# EAGLE design combined_timer+remote (EAGLE 9.6.2)

## Sheet 1 of 3
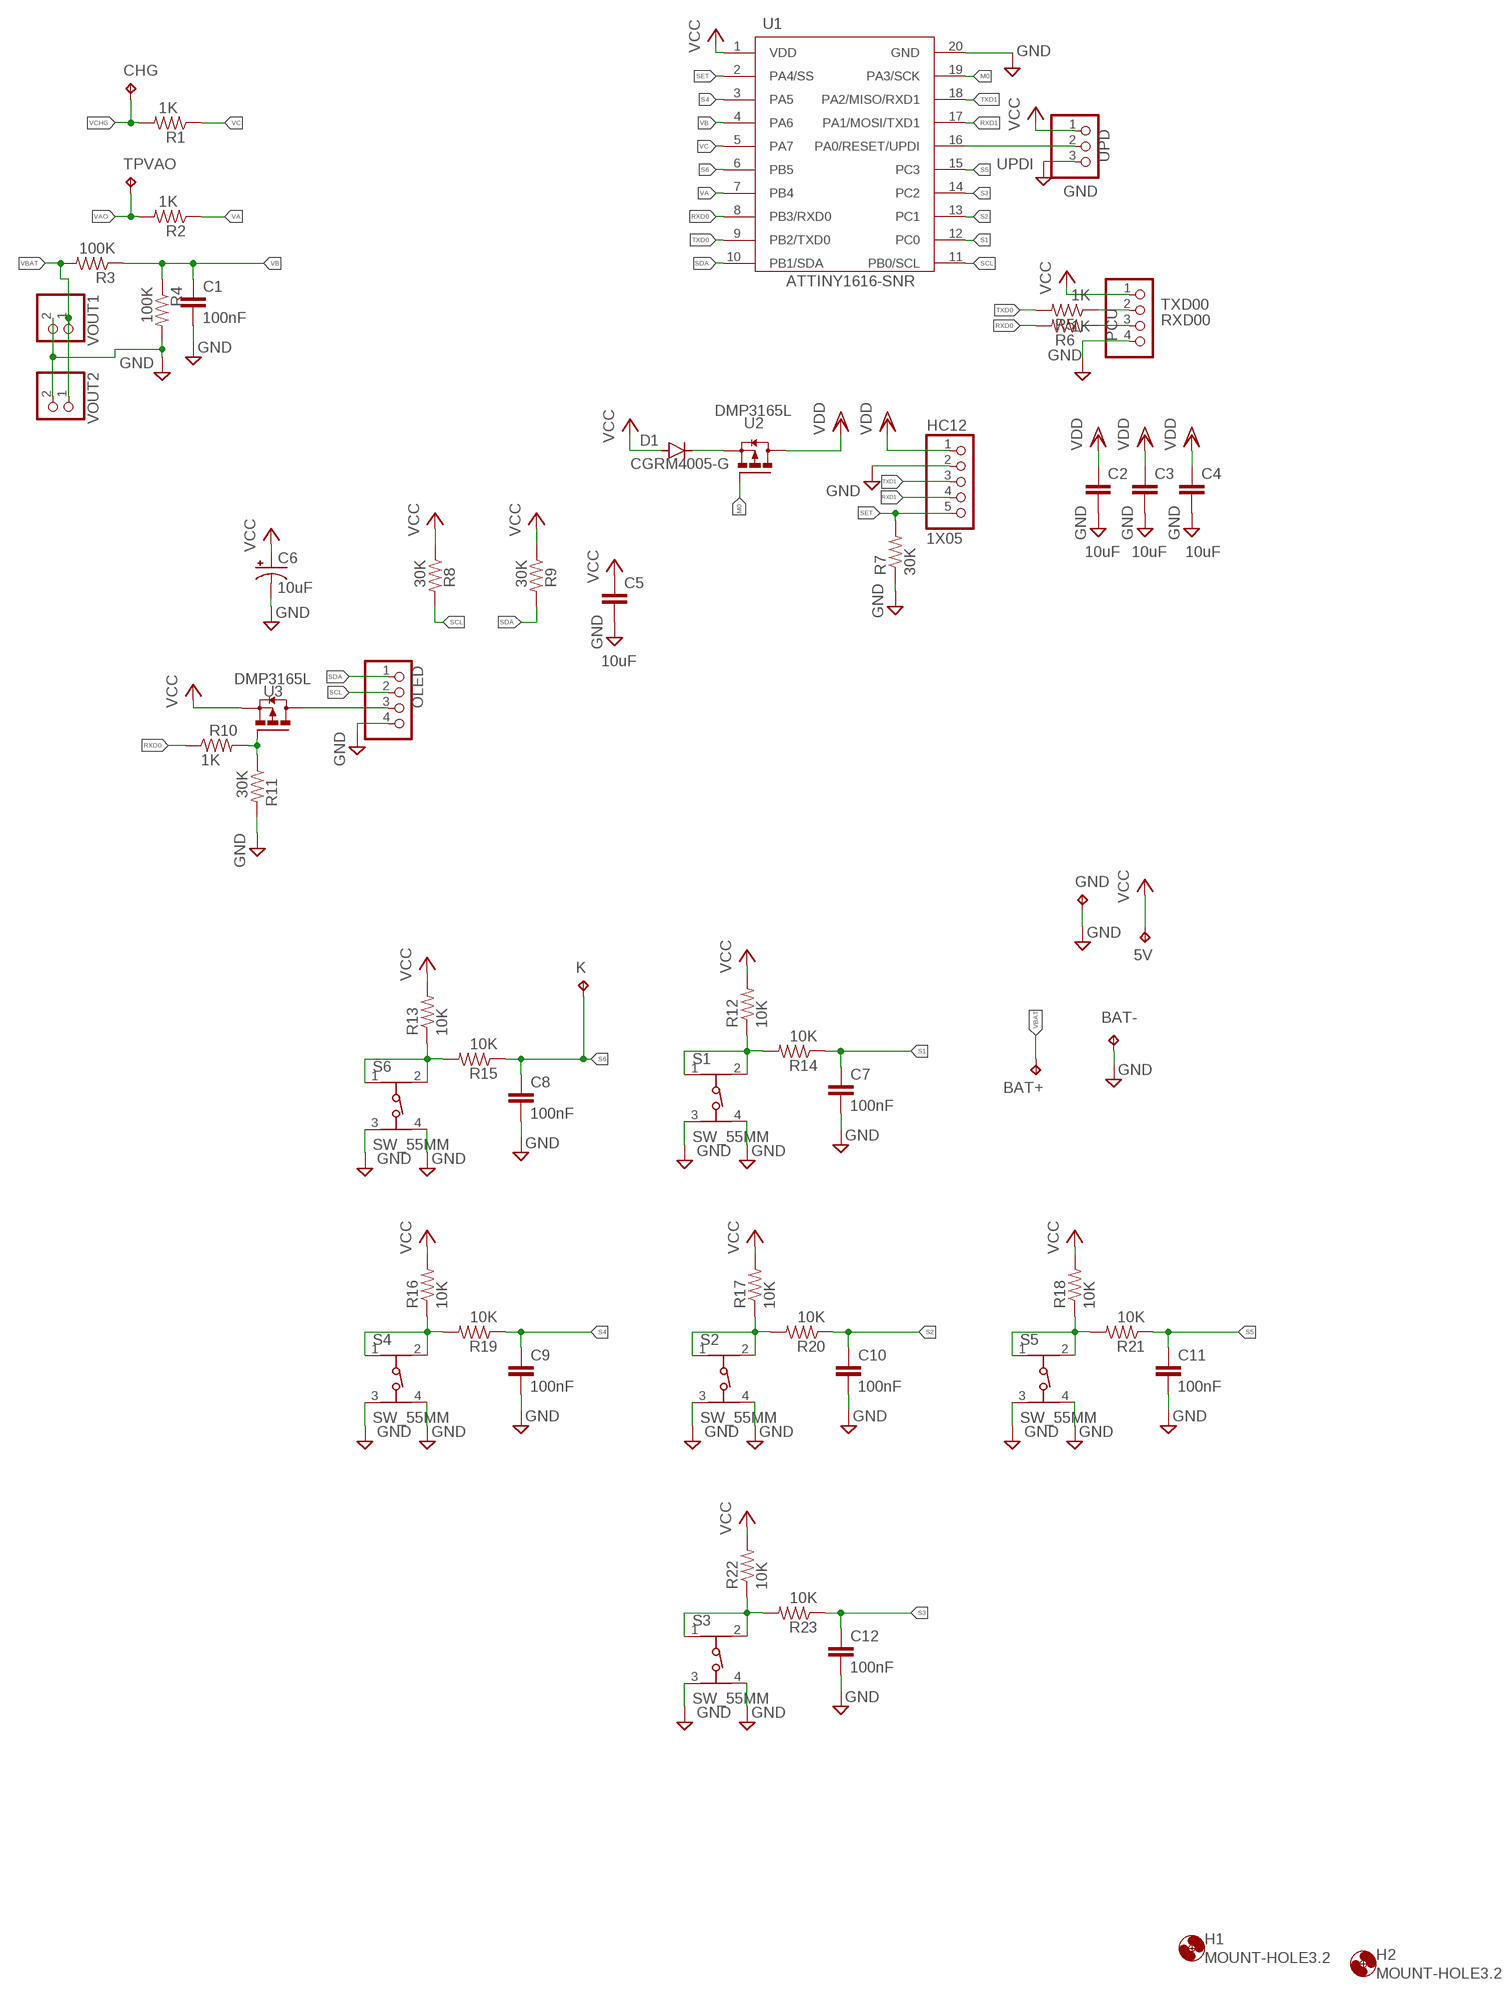
[diagram p0: schematic, sheet 1, part 1 of 2]
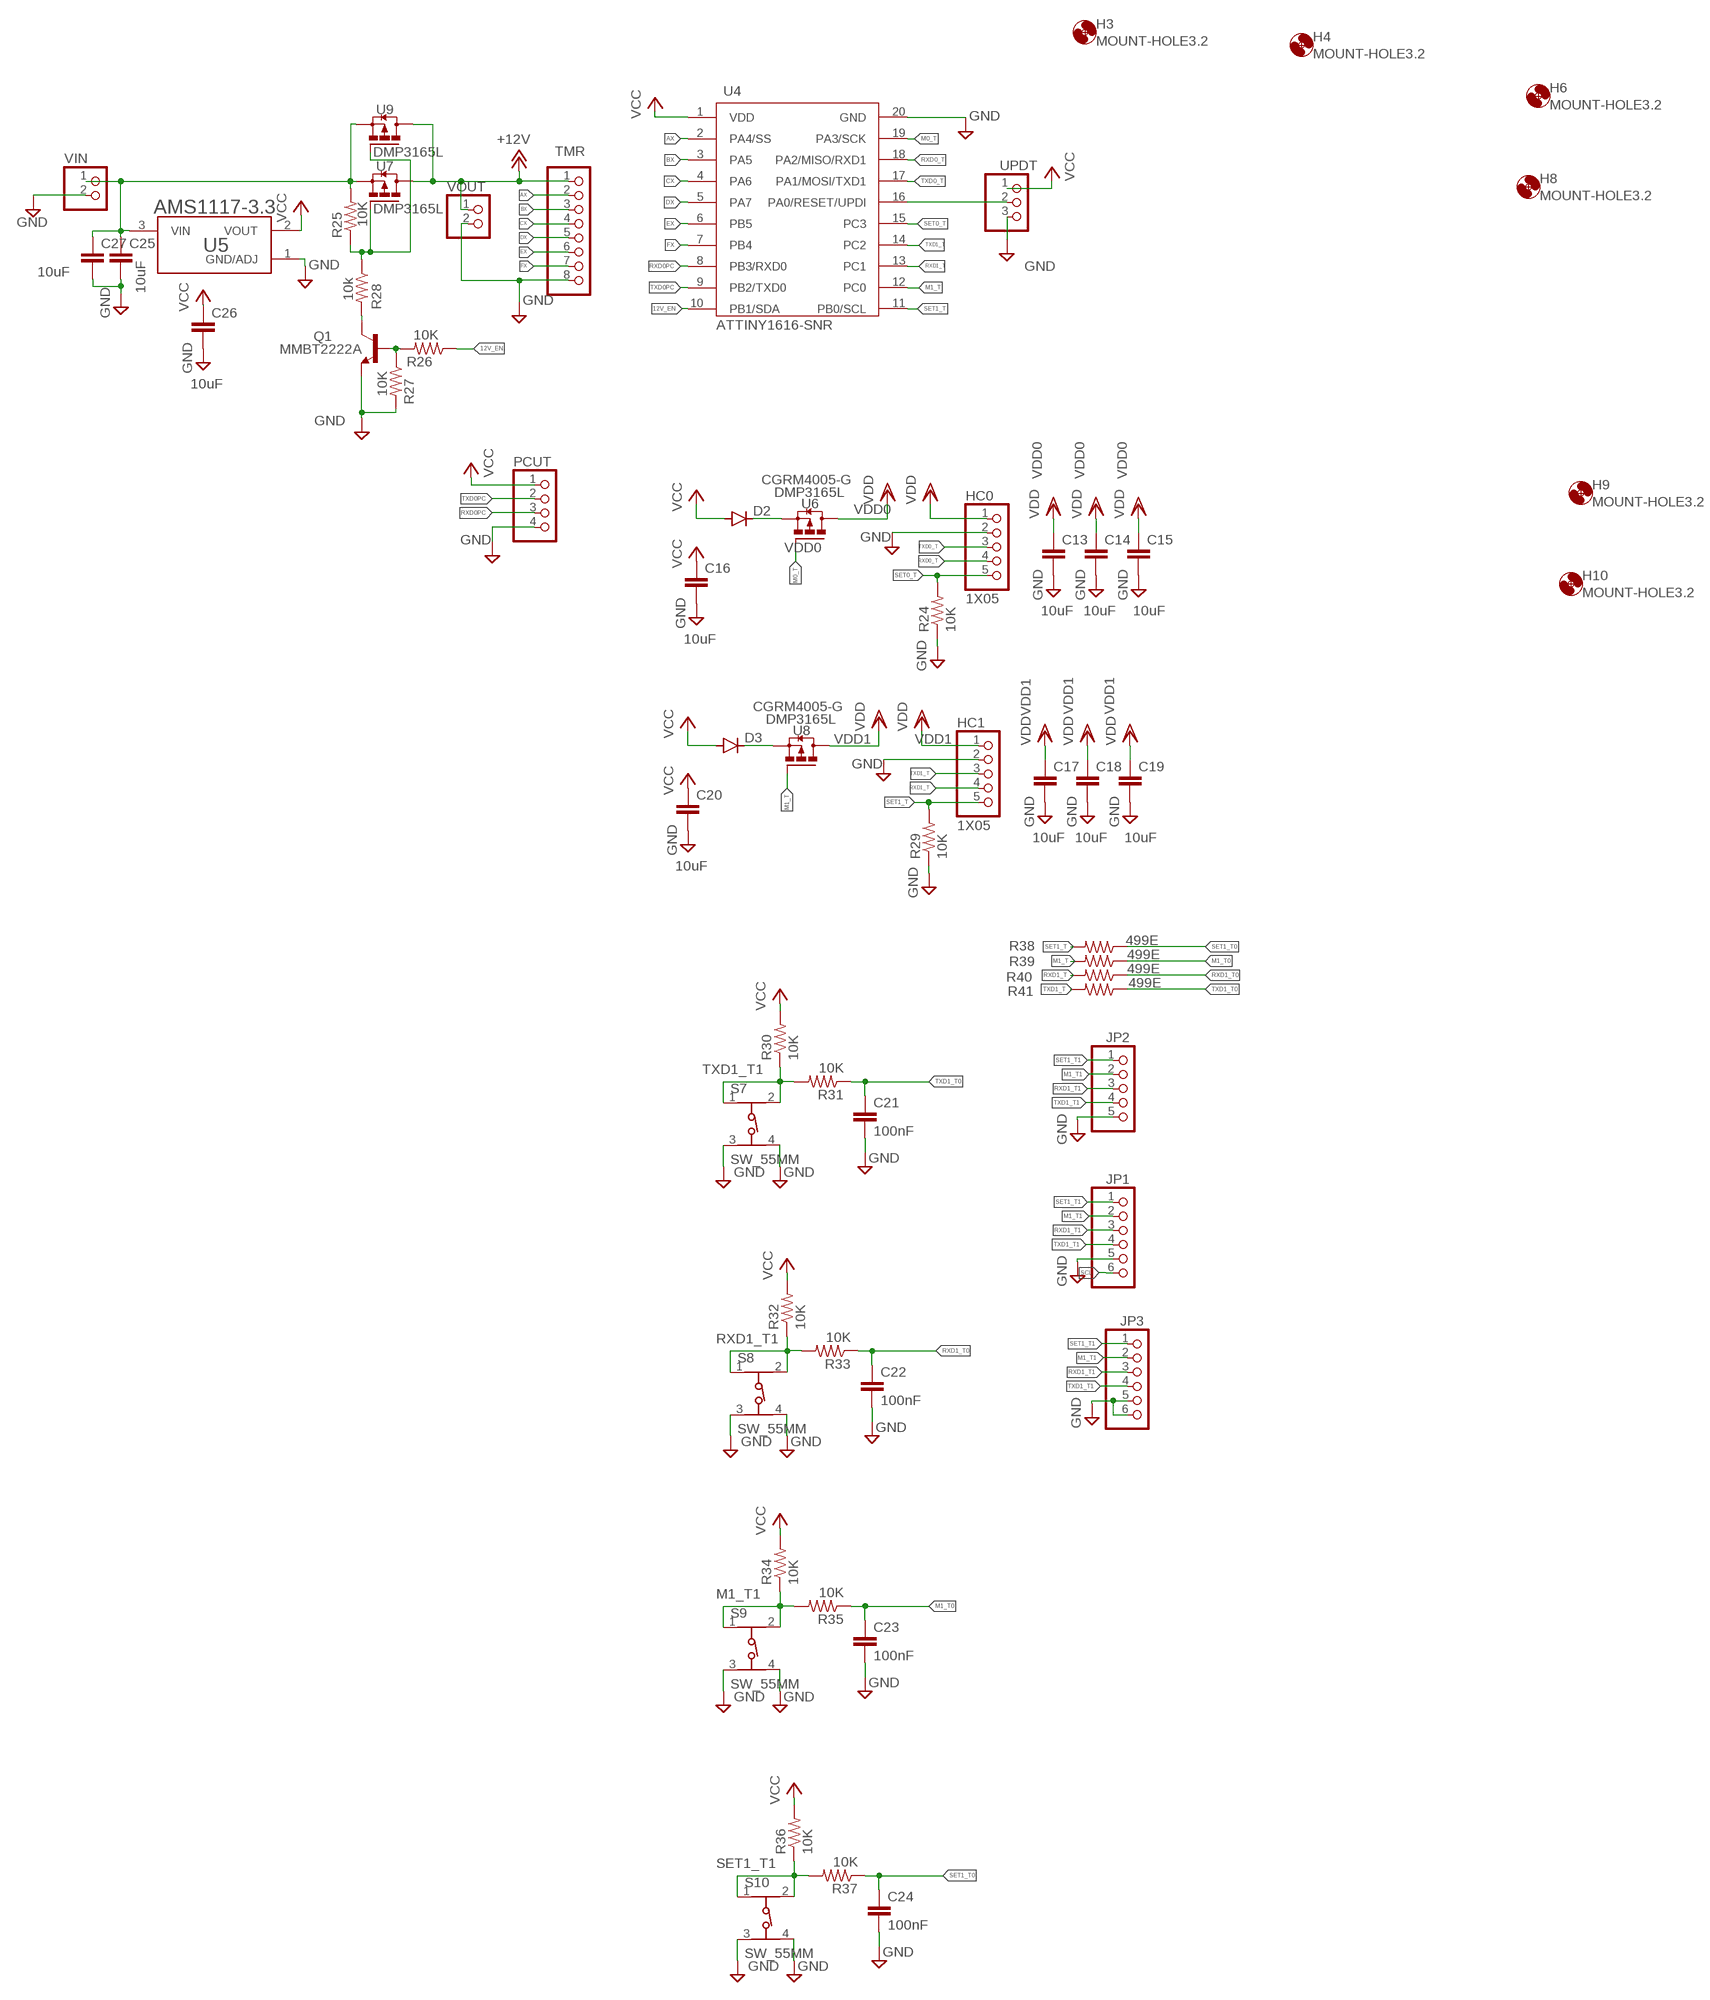
[diagram p1: schematic, sheet 1, part 2 of 2]

### Parts
5V  TPTP18R  [TP18R]
BAT+  TPTP18R  [TP18R]
BAT-  TPTP18R  [TP18R]
C1  100nF  C-EUC0603K  [C0603K]
C2  10uF  C-EUC0805  [C0805]
C3  10uF  C-EUC0805  [C0805]
C4  10uF  C-EUC0805  [C0805]
C5  10uF  C-EUC0805  [C0805]
C6  10uF  CPOL-USCT3528  [CT3528]
C7  100nF  C-EUC0603K  [C0603K]
C8  100nF  C-EUC0603K  [C0603K]
C9  100nF  C-EUC0603K  [C0603K]
C10  100nF  C-EUC0603K  [C0603K]
C11  100nF  C-EUC0603K  [C0603K]
C12  100nF  C-EUC0603K  [C0603K]
C13  10uF  C-EUC0805  [C0805]
C14  10uF  C-EUC0805  [C0805]
C15  10uF  C-EUC0805  [C0805]
C16  10uF  C-EUC0805  [C0805]
C17  10uF  C-EUC0805  [C0805]
C18  10uF  C-EUC0805  [C0805]
C19  10uF  C-EUC0805  [C0805]
C20  10uF  C-EUC0805  [C0805]
C21  100nF  C-EUC0603K  [C0603K]
C22  100nF  C-EUC0603K  [C0603K]
C23  100nF  C-EUC0603K  [C0603K]
C24  100nF  C-EUC0603K  [C0603K]
C25  10uF  C-EUC0805  [C0805]
C26  10uF  C-EUC0805  [C0805]
C27  10uF  C-EUC0805  [C0805]
CHG  TPTP18R  [TP18R]
D1  CGRM4005-G  [SOD-123_MINI-SMA]
D2  CGRM4005-G  [SOD-123_MINI-SMA]
D3  CGRM4005-G  [SOD-123_MINI-SMA]
GND  TPTP18R  [TP18R]
H1  MOUNT-HOLE3.2  [3,2]
H2  MOUNT-HOLE3.2  [3,2]
H3  MOUNT-HOLE3.2  [3,2]
H4  MOUNT-HOLE3.2  [3,2]
H6  MOUNT-HOLE3.2  [3,2]
H8  MOUNT-HOLE3.2  [3,2]
H9  MOUNT-HOLE3.2  [3,2]
H10  MOUNT-HOLE3.2  [3,2]
HC0  1X05  [1X05X254]
HC1  1X05  [1X05X254]
HC12  1X05  [1X05X254]
JP1  PINHD-1X06_2.54-S  [1X06-S]
JP2  PINHD-1X5  [1X05]
JP3  PINHD-1X06_2.54-S  [1X06-S]
K  TPTP18R  [TP18R]
OLED  PINHD-1X04_2.54-S  [1X04-S]
PCU  PINHD-1X04_2.54-S  [1X04-S]
PCUT  PINHD-1X04_2.54-S  [1X04-S]
Q1  MMBT2222A  [SOT23]
R1  1K  R-US_R0603  [R0603]
R2  1K  R-US_R0603  [R0603]
R3  100K  R-US_R0603  [R0603]
R4  100K  R-US_R0603  [R0603]
R5  1K  R-US_R0805  [R0805]
R6  1K  R-US_R0805  [R0805]
R7  30K  R-US_R0603  [R0603]
R8  30K  R-US_R0603  [R0603]
R9  30K  R-US_R0603  [R0603]
R10  1K  R-US_R0603  [R0603]
R11  30K  R-US_R0603  [R0603]
R12  10K  R-US_R0603  [R0603]
R13  10K  R-US_R0603  [R0603]
R14  10K  R-US_R0603  [R0603]
R15  10K  R-US_R0603  [R0603]
R16  10K  R-US_R0603  [R0603]
R17  10K  R-US_R0603  [R0603]
R18  10K  R-US_R0603  [R0603]
R19  10K  R-US_R0603  [R0603]
R20  10K  R-US_R0603  [R0603]
R21  10K  R-US_R0603  [R0603]
R22  10K  R-US_R0603  [R0603]
R23  10K  R-US_R0603  [R0603]
R24  10K  R-US_R0603  [R0603]
R25  10K  R-US_R0603  [R0603]
R26  10K  R-US_R0603  [R0603]
R27  10K  R-US_R0603  [R0603]
R28  10k  R-US_R0603  [R0603]
R29  10K  R-US_R0603  [R0603]
R30  10K  R-US_R0603  [R0603]
R31  10K  R-US_R0603  [R0603]
R32  10K  R-US_R0603  [R0603]
R33  10K  R-US_R0603  [R0603]
R34  10K  R-US_R0603  [R0603]
R35  10K  R-US_R0603  [R0603]
R36  10K  R-US_R0603  [R0603]
R37  10K  R-US_R0603  [R0603]
R38  499E  R-US_R0603  [R0603]
R39  499E  R-US_R0603  [R0603]
R40  499E  R-US_R0603  [R0603]
R41  499E  R-US_R0603  [R0603]
S1  SW_55MM  [SW_55MM]
S2  SW_55MM  [SW_55MM]
S3  SW_55MM  [SW_55MM]
S4  SW_55MM  [SW_55MM]
S5  SW_55MM  [SW_55MM]
S6  SW_55MM  [SW_55MM]
S7  SW_55MM  [SW_55MM]
S8  SW_55MM  [SW_55MM]
S9  SW_55MM  [SW_55MM]
S10  SW_55MM  [SW_55MM]
TMR  PINHD-1X08_2.54-S  [1X08-S]
TPVAO  TPTP18R  [TP18R]
U1  ATTINY1616-SNR  [SOIC127P1032X265-20N]
U2  DMP3165L  [SOT103P240X110-3N]
U3  DMP3165L  [SOT103P240X110-3N]
U4  ATTINY1616-SNR  [SOIC127P1032X265-20N]
U5  AMS1117-3.3  [SOT229P700X180-4N]
U6  DMP3165L  [SOT103P240X110-3N]
U7  DMP3165L  [SOT103P240X110-3N]
U8  DMP3165L  [SOT103P240X110-3N]
U9  DMP3165L  [SOT103P240X110-3N]
UPD  PINHD-1X03_2.54-S  [1X03-S]
UPDT  PINHD-1X03_2.54-S  [1X03-S]
VIN  PINHD-1X2  [1X02]
VOUT  PINHD-1X2  [1X02]
VOUT1  PINHD-1X02_2.54-S  [1X02-S]
VOUT2  PINHD-1X02_2.54-S  [1X02-S]

### Nets
12V_EN: R26.1 U4.10(PB1/SDA)
12VIN: C25.1 C27.1 R25.2 U5.3(VIN) U7.2(S) U9.2(S) VIN.1
+12V: TMR.1 U7.3(D) U9.3(D) VOUT.1
AX: TMR.2 U4.2(PA4/SS)
BX: TMR.3 U4.3(PA5)
CX: TMR.4 U4.4(PA6)
DX: TMR.5 U4.5(PA7)
EX: TMR.6 U4.6(PB5)
FX: TMR.7 U4.7(PB4)
GND: BAT-.TP C1.2 C2.2 C3.2 C4.2 C5.2 C6.- C7.2 C8.2 C9.2 C10.2 C11.2 C12.2 C13.2 C14.2 C15.2 C16.2 C17.2 C18.2 C19.2 C20.2 C21.2 C22.2 C23.2 C24.2 C25.2 C26.2 C27.2 GND.TP HC0.2 HC1.2 HC12.2 JP1.5 JP2.5 JP3.5 JP3.6 OLED.4 PCU.4 PCUT.4 Q1.2(E) R4.2 R7.1 R11.2 R24.1 R27.2 R29.1 S1.3 S1.4 S2.3 S2.4 S3.3 S3.4 S4.3 S4.4 S5.3 S5.4 S6.3 S6.4 S7.3 S7.4 S8.3 S8.4 S9.3 S9.4 S10.3 S10.4 TMR.8 U1.20(GND) U4.20(GND) U5.1(GND/ADJ) UPD.3 UPDT.3 VIN.2 VOUT1.2 VOUT2.2 VOUT.2
M0: U1.19(PA3/SCK) U2.1(G)
M0_T: U4.19(PA3/SCK) U6.1(G)
M1_T: R39.2 U4.12(PC0) U8.1(G)
M1_T0: C23.1 R35.1 R39.1
M1_T1: JP1.2 JP2.2 JP3.2 R34.1 R35.2 S9.1 S9.2
N$1: R13.1 R15.2 S6.1 S6.2
N$2: D1.C U2.2(S)
N$3: OLED.3 U3.3(D)
N$4: R10.2 R11.1 U3.1(G)
N$5: R17.1 R20.2 S2.1 S2.2
N$6: D2.C U6.2(S)
N$8: R22.1 R23.2 S3.1 S3.2
N$9: R16.1 R19.2 S4.1 S4.2
N$10: R18.1 R21.2 S5.1 S5.2
N$11: Q1.1(B) R26.2 R27.1
N$12: R12.1 R14.2 S1.1 S1.2
N$13: Q1.3(C) R28.2
N$14: D3.C U8.2(S)
N$17: R25.1 R28.1 U7.1(G) U9.1(G)
N$23: U4.16(PA0/RESET/UPDI) UPDT.2
RXD0: R6.2 R10.1 U1.8(PB3/RXD0)
RXD00: PCU.3 R6.1
RXD0_T: HC0.4 U4.18(PA2/MISO/RXD1)
RXD0PC: PCUT.3 U4.8(PB3/RXD0)
RXD1: HC12.4 U1.17(PA1/MOSI/TXD1)
RXD1_T: HC1.4 R40.2 U4.13(PC1)
RXD1_T0: C22.1 R33.1 R40.1
RXD1_T1: JP1.3 JP2.3 JP3.3 R32.1 R33.2 S8.1 S8.2
S1: C7.1 R14.1 U1.12(PC0)
S2: C10.1 R20.1 U1.13(PC1)
S3: C12.1 R23.1 U1.14(PC2)
S4: C9.1 R19.1 U1.3(PA5)
S5: C11.1 R21.1 U1.15(PC3)
S6: C8.1 K.TP R15.1 U1.6(PB5)
SCL: JP1.6 OLED.2 R8.2 U1.11(PB0/SCL)
SDA: OLED.1 R9.2 U1.10(PB1/SDA)
SET: HC12.5 R7.2 U1.2(PA4/SS)
SET0_T: HC0.5 R24.2 U4.15(PC3)
SET1_T: HC1.5 R29.2 R38.2 U4.11(PB0/SCL)
SET1_T0: C24.1 R37.1 R38.1
SET1_T1: JP1.1 JP2.1 JP3.1 R36.1 R37.2 S10.1 S10.2
TXD0: R5.2 U1.9(PB2/TXD0)
TXD00: PCU.2 R5.1
TXD0_T: HC0.3 U4.17(PA1/MOSI/TXD1)
TXD0PC: PCUT.2 U4.9(PB2/TXD0)
TXD1: HC12.3 U1.18(PA2/MISO/RXD1)
TXD1_T: HC1.3 R41.2 U4.14(PC2)
TXD1_T0: C21.1 R31.1 R41.1
TXD1_T1: JP1.4 JP2.4 JP3.4 R30.1 R31.2 S7.1 S7.2
UPDI: U1.16(PA0/RESET/UPDI) UPD.2
VA: R2.1 U1.7(PB4)
VAO: R2.2 TPVAO.TP
VB: C1.1 R3.1 R4.1 U1.4(PA6)
VBAT: BAT+.TP R3.2 VOUT1.1 VOUT2.1
VC: R1.1 U1.5(PA7)
VCC: 5V.TP C5.1 C6.+ C16.1 C20.1 C26.1 D1.A D2.A D3.A PCU.1 PCUT.1 R8.1 R9.1 R12.2 R13.2 R16.2 R17.2 R18.2 R22.2 R30.2 R32.2 R34.2 R36.2 U1.1(VDD) U3.2(S) U4.1(VDD) U5.2(VOUT) UPD.1 UPDT.1
VCHG: CHG.TP R1.2
VDD: C2.1 C3.1 C4.1 HC12.1 U2.3(D)
VDD0: C13.1 C14.1 C15.1 HC0.1 U6.3(D) ; supply symbol labelled VDD
VDD1: C17.1 C18.1 C19.1 HC1.1 U8.3(D) ; supply symbol labelled VDD

## Sheet 2 of 3

## Sheet 3 of 3

## Library data of the parts
5V BAT+ BAT- CHG GND K TPVAO = testpad:TP: Test pad
C1-C5 C7-C27 = rcl:C-EU: CAPACITOR, European symbol; SPICEPREFIX: C
C6 = rcl:CPOL-US: POLARIZED CAPACITOR, American symbol; SPICEPREFIX: C
D1-D3 = diode:CGRM400*-G: Molded plasitc,JEDEC SOD-123/Mini SMA Source: Comchip CGRM4001-G.pdf
H1-H4 H6 H8-H10 = holes:MOUNT-HOLE: MOUNTING HOLE with drill center marker
HC0 HC1 HC12 = pinhead_smd:1X05
JP1 JP3 = pinhead-2:PINHD-1X06: PIN HEADER
JP2 = pinhead:PINHD-1X5: PIN HEADER
OLED PCU PCUT = pinhead-2:PINHD-1X04: PIN HEADER
Q1 = MMBT2222A:MMBT2222A: 2N2222 General Purpose NPN Transistor Check availability <https://pricing.snapeda.com/parts/MMBT2222A/STMicroelectronics/view-part?ref=eda>; AVAILABILITY: In Stock; CHECK_PRICES: https://www.snapeda.com/parts/MMBT2222A/STMicroelectronics/view-part/?ref=eda; DESCRIPTION: Bipolar (BJT) Transistor NPN 40V 600mA 300MHz 310mW Surface Mount SOT-23-3; MF: STMicroelectronics; MP: MMBT2222A; PACKAGE: SOT-23 Multicomp; PRICE: None; SNAPEDA_LINK: https://www.snapeda.com/parts/MMBT2222A/STMicroelectronics/view-part/?ref=snap
R1-R41 = rcl:R-US_: RESISTOR, American symbol; SPICEPREFIX: R
S1-S10 = switch_5p5mm:SW_55MM: Tactile Switches 50mA 12VDC, 2.5N 3.8mm H, G leads Source: Datasheet <https://www.ckswitches.com/media/2567/pts647.pdf> Check availability <https://pricing.snapeda.com/parts/PTS%20647%20SK38%20SMTR2%20LFS/C%26K/view-part?ref=eda>; AVAILABILITY: In Stock; CHECK_PRICES: https://www.snapeda.com/parts/PTS%20647%20SK38%20SMTR2%20LFS/C%2526K/view-part/?ref=eda; DESCRIPTION: Tactile Switch SPST-NO Top Actuated Surface Mount; MF: C&K; MP: PTS 647 SK38 SMTR2 LFS; PACKAGE: None; PRICE: None; PURCHASE-URL: https://www.snapeda.com/api/url_track_click_mouser/?unipart_id=4834952&manufacturer=C&amp;K&part_name=PTS 647 SK38 SMTR2 LFS&search_term=pts647; SNAPEDA_LINK: https://www.snapeda.com/parts/PTS%20647%20SK38%20SMTR2%20LFS/C%2526K/view-part/?ref=snap
TMR = pinhead-2:PINHD-1X08: PIN HEADER
U1 U4 = ATTINY1616-SNR:ATTINY1616-SNR: ATTiny1616 is a 20 pin Microcontroller with: - 5 selectable Voltage reference - 8 bit Dac - Multiplexable IOs(SPI, UART, I2C) And much more Datasheet <http://ww1.microchip.com/downloads/en/DeviceDoc/ATtiny1616-3216-DataSheet-DS40001997C.pdf> Check availability <https://pricing.snapeda.com/parts/ATTINY1616-SNR/Microchip%20Technology/view-part?ref=eda>; AVAILABILITY: In Stock; DESCRIPTION: AVR tinyAVR™ 1, Functional Safety (FuSa) Microcontroller IC 8-Bit 20MHz 16KB (16K x 8) FLASH 20-SOIC; MF: Microchip Technology; MP: ATTINY1616-SNR; PACKAGE: SOIC-20 Microchip; PRICE: None; PURCHASE-URL: https://pricing.snapeda.com/search/part/ATTINY1616-SNR/?ref=eda
U2 U3 U6-U9 = DMP3165L:DMP3165L: P-CHANNEL ENHANCEMENT MODE MOSFET Check availability <https://pricing.snapeda.com/parts/DMP3130L-7/Diodes%20Inc./view-part?ref=eda>; AVAILABILITY: In Stock; CHECK_PRICES: https://www.snapeda.com/parts/DMP3130L-7/Diodes+Inc./view-part/?ref=eda; DESCRIPTION: P-Channel 30 V 3.5A (Ta) 700mW (Ta) Surface Mount SOT-23-3; MF: Diodes Inc.; MP: DMP3130L-7; PACKAGE: SOT-23 Diodes Inc.; PRICE: None; PURCHASE-URL: https://pricing.snapeda.com/search?q=DMP3130L-7&ref=eda; SNAPEDA_LINK: https://www.snapeda.com/parts/DMP3130L-7/Diodes+Inc./view-part/?ref=snap
U5 = AMS1117-3.3:AMS1117-3.3: Check availability <https://pricing.snapeda.com/parts/AMS1117-3.3/Advanced%20Monolithic%20Systems/view-part?ref=eda>; AVAILABILITY: Not in stock; CHECK_PRICES: https://www.snapeda.com/parts/AMS1117-3.3/Advanced+Monolithic+Systems/view-part/?ref=eda; DESCRIPTION: Sot223/Pkg 1-Amp 3.3-Volt Low Drop Out Voltage Regulatator; MF: Advanced Monolithic Systems; MP: AMS1117-3.3; PACKAGE: SOT-223 Seeed Technology; PRICE: None; SNAPEDA_LINK: https://www.snapeda.com/parts/AMS1117-3.3/Advanced+Monolithic+Systems/view-part/?ref=snap
UPD UPDT = pinhead-2:PINHD-1X03: PIN HEADER
VIN VOUT = pinhead:PINHD-1X2: PIN HEADER
VOUT1 VOUT2 = pinhead-2:PINHD-1X02: PIN HEADER

## Net classes
0 default: width 0.254 mm, clearance 0.254 mm

## Board
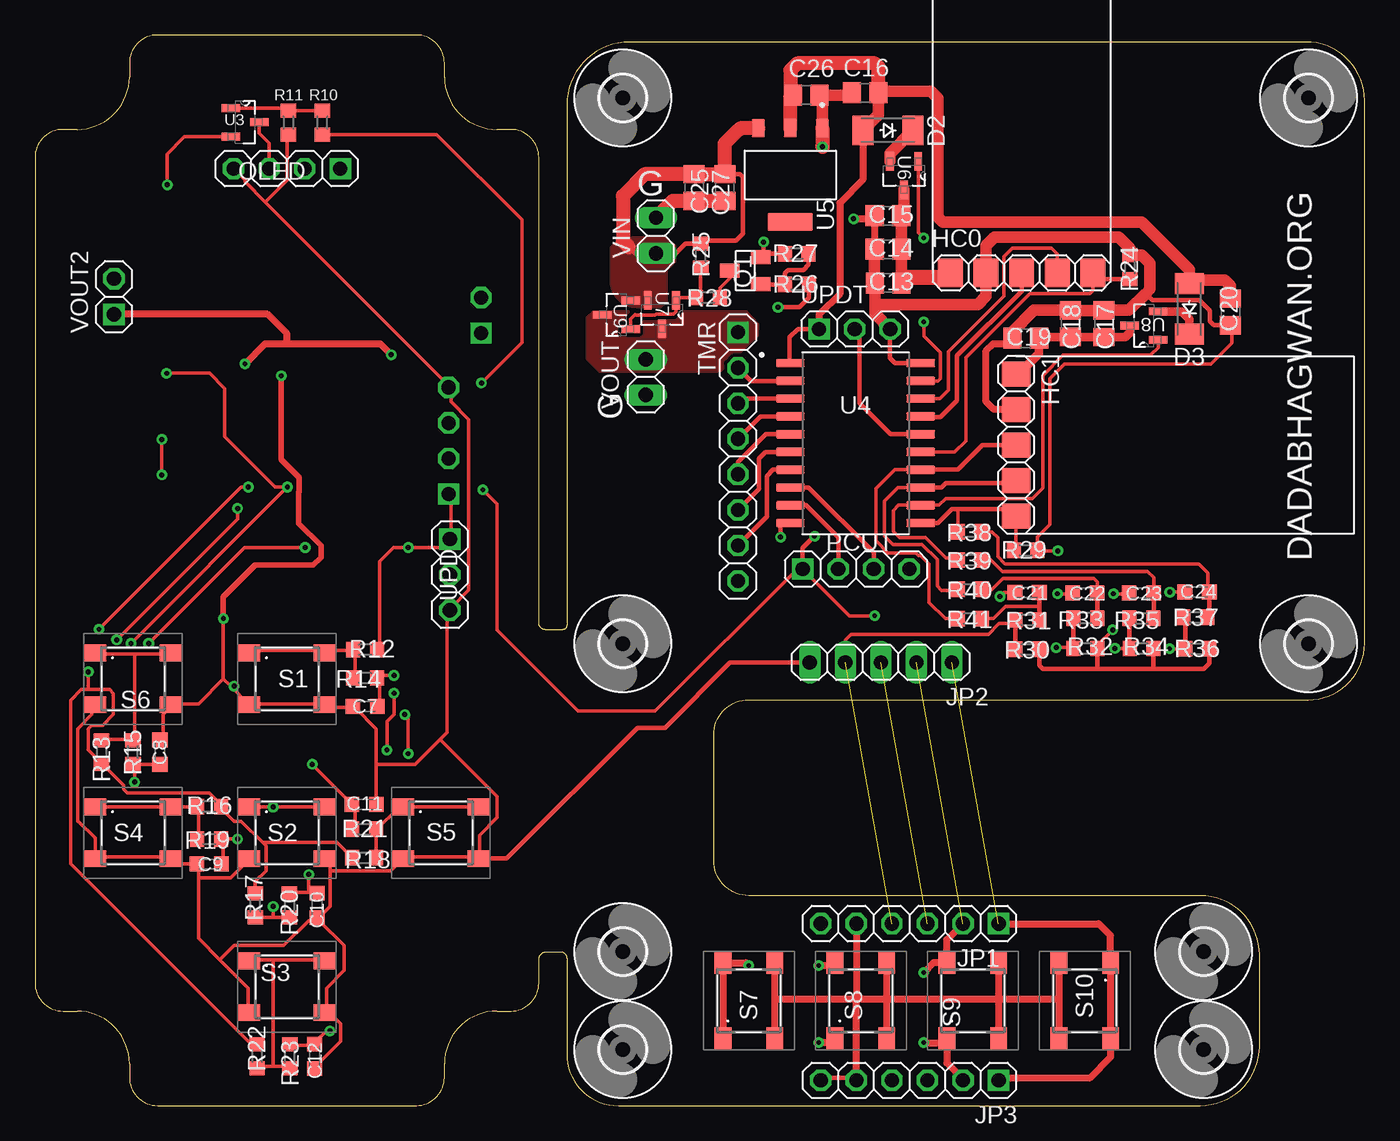
[diagram p2: board, top side]
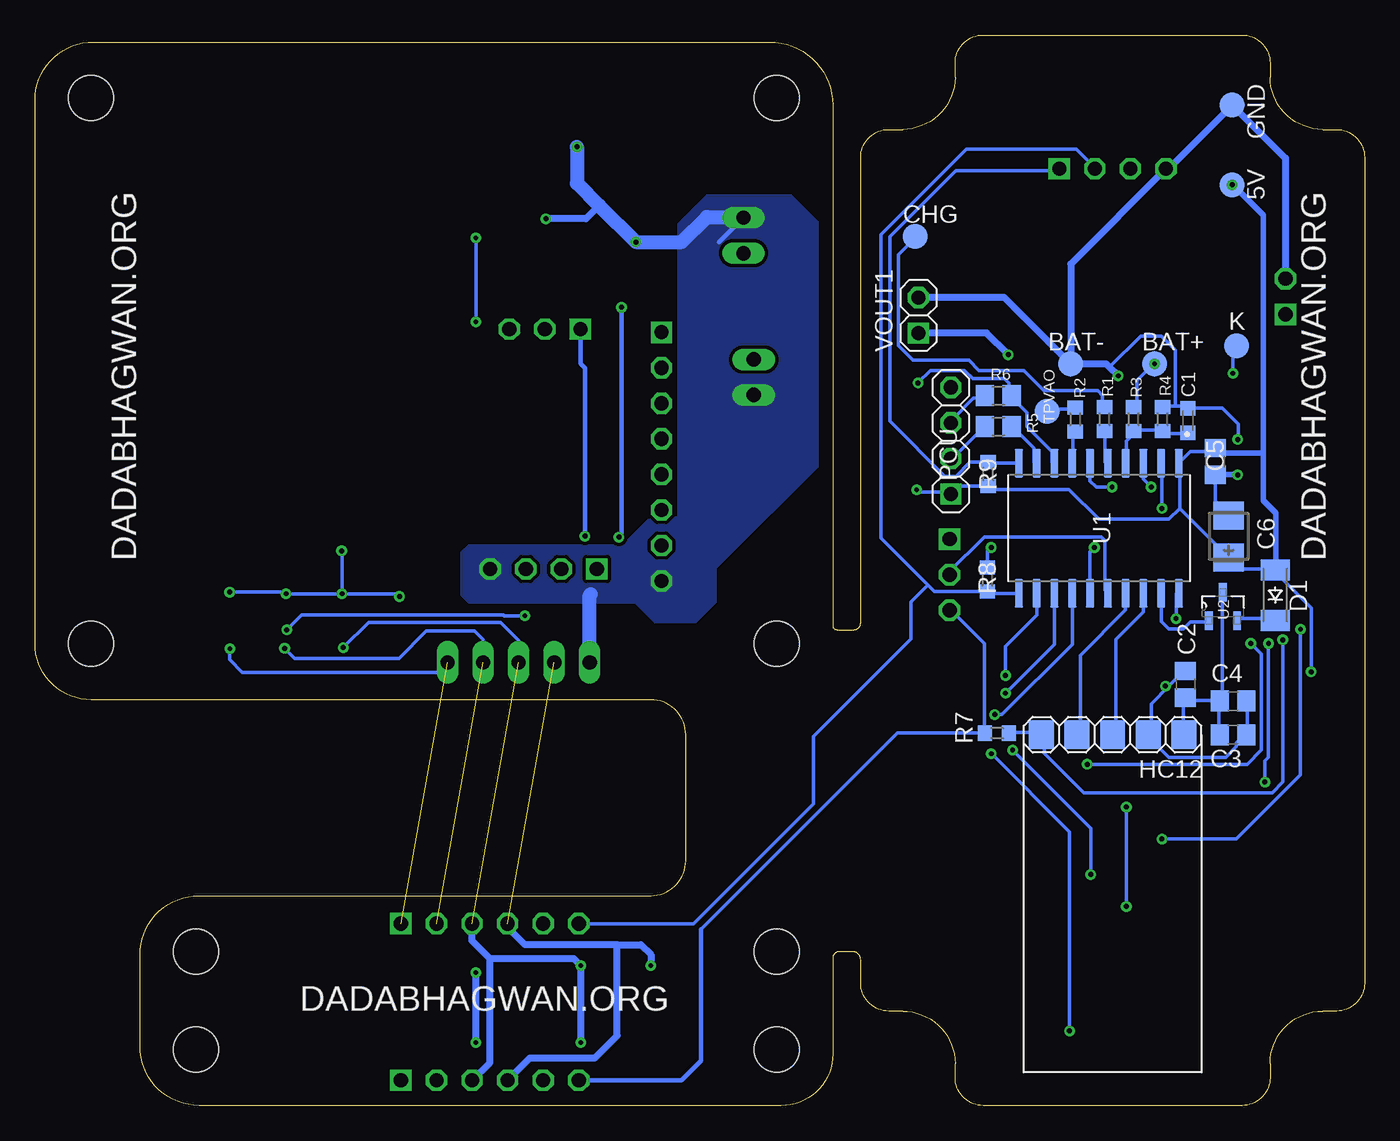
[diagram p3: board, bottom side, seen from below]

Size 95 x 76.5 mm. Coordinates in mm from the lower left corner, seen from the top.
Outline: 3,69.75 2,69.75 arc90 0,67.75 0,8.75 arc90 2,6.75 3,6.75 arc-90 6.75,3 6.75,2 arc90 8.75,0 27.25,0 arc90 29.25,2 29.25,3 arc-90 33,6.75 34,6.75 arc90 36,8.75 36,10.42 arc-90 36.58,11 37.52,11 arc-90 38,10.52 38,3.68 arc90 41.68,0 83.27,0 arc90 87.5,4.23 87.5,10.77 arc90 83.27,15 51,15 arc-90 48.5,17.5 48.5,26.5 arc-90 51,29 90.98,29 arc90 95,33.02 95,71.83 arc90 90.83,76 42.51,76 arc90 38,71.5 38,34.32 arc-90 37.68,34 36.49,34 arc-90 36,34.49 36,67.75 arc90 34,69.75 33,69.75 arc-90 29.25,73.5 29.25,74.5 arc90 27.25,76.5 8.75,76.5 arc90 6.75,74.5 6.75,73.5 arc-90 3,69.75
Copper layers (1*16): Top 0.035mm / dielectric 1.5mm / Bottom 0.035mm
Design rules "default *": minimum track width 8mil, minimum drill 0.35mm, track to track 8mil, track to pad 8mil, pad to pad 8mil, via to via 8mil, smd to smd 6mil, copper to edge 40mil, drill to drill 6mil, minimum pad ring 10mil, minimum via ring 8mil, stop-mask expansion 4mil, vias tented up to drill 0mil, thermal gap 10mil

### Footprints (pad centres in the part's own frame; a part is rotated, then mirrored left to right if it is on the bottom)
TP18R = smd 1.8 x 1.8: TP 0,0
C0603K = smd 1.05 x 1.08: 1 -0.875,0; 2 0.875,0
C0805 = smd 1.3 x 1.5: 1 -0.95,0; 2 0.95,0
CT3528 = smd 2 x 2.2: + -1.5,0; - 1.5,0
SOD-123_MINI-SMA = smd 1.5 x 2.1: A 1.8,0; C -1.8,0
3,2 = hole 3.2: 0,0
1X05X254 = smd 1.778 x 2.032: 1 -5.08,0; 2 -2.54,0; 3 0,0; 4 2.54,0; 5 5.08,0
1X06-S = drill 1.016 square: 1 -6.35,0 | drill 1.016 octagon: 2 -3.81,0; 3 -1.27,0; 4 1.27,0; 5 3.81,0; 6 6.35,0
1X05 = drill 1.016 long: 1 -5.08,0; 2 -2.54,0; 3 0,0; 4 2.54,0; 5 5.08,0
1X04-S = drill 1.016 square: 1 -3.81,0 | drill 1.016 octagon: 2 -1.27,0; 3 1.27,0; 4 3.81,0
SOT23 = smd 1 x 1.4: 1 -0.95,-1.1; 2 0.95,-1.1; 3 0,1.1
R0603 = smd 1 x 1.1: 1 -0.85,0; 2 0.85,0
R0805 = smd 1.3 x 1.5: 1 -0.95,0; 2 0.95,0
SW_55MM = smd 1.55 x 1.2: 1 -2.7,1.85; 2 2.7,1.85; 3 -2.7,-1.85; 4 2.7,-1.85
1X08-S = drill 1.016 square: 1 -8.89,0 | drill 1.016 octagon: 2 -6.35,0; 3 -3.81,0; 4 -1.27,0; 5 1.27,0; 6 3.81,0; 7 6.35,0; 8 8.89,0
SOIC127P1032X265-20N = smd 2.05 x 0.6: 1 -4.655,5.715; 2 -4.655,4.445; 3 -4.655,3.175; 4 -4.655,1.905; 5 -4.655,0.635; 6 -4.655,-0.635; 7 -4.655,-1.905; 8 -4.655,-3.175; 9 -4.655,-4.445; 10 -4.655,-5.715; 11 4.655,-5.715; 12 4.655,-4.445; 13 4.655,-3.175; 14 4.655,-1.905; 15 4.655,-0.635; 16 4.655,0.635; 17 4.655,1.905; 18 4.655,3.175; 19 4.655,4.445; 20 4.655,5.715
SOT103P240X110-3N = smd 1.321 x 0.559: 1 -1.016,1.016; 2 -1.016,-1.016; 3 1.016,0
SOT229P700X180-4N = smd 1.31 x 0.93: 1 -3.345,2.29; 2 -3.345,0; 3 -3.345,-2.29 | smd 1.31 x 3.24: 4 3.345,0
1X03-S = drill 1.016 square: 1 -2.54,0 | drill 1.016 octagon: 2 0,0; 3 2.54,0
1X02 = drill 1.016 long: 1 -1.27,0; 2 1.27,0
1X02-S = drill 1.016 square: 1 -1.27,0 | drill 1.016 octagon: 2 1.27,0

### Placement (x,y rotation side)
5V  9.45,65.8 0 bottom
BAT+  15,53 0 bottom
BAT-  21,53 0 bottom
C1  12.63,48.95 90 bottom
C2  12.8,30.1 90 bottom
C3  9.4,26.5 0 bottom
C4  9.4,28.9 0 bottom
C5  10.67,46.02 270 bottom
C6  9.72,40.67 90 bottom
C7  23.59,28.52 180 top
C8  8.93,25.25 90 top
C9  12.45,17.26 180 top
C10  20.16,14.3 270 top
C11  23.51,21.52 0 top
C12  19.98,3.52 270 top
C13  60.97,58.78 180 top
C14  60.96,61.18 180 top
C15  60.95,63.58 180 top
C16  59.32,72.37 180 top
C17  76.38,55.87 90 top
C18  73.98,55.88 90 top
C19  70.79,54.83 180 top
C20  85.42,56.71 270 top
C21  70.89,36.67 180 top
C22  75.02,36.63 180 top
C23  79.06,36.63 180 top
C24  83.03,36.69 180 top
C25  49.3,65.6 270 top
C26  55.1,72.2 0 top
C27  47.1,65.6 270 top
CHG  32.1,62.1 0 bottom
D1  6.38,36.47 90 bottom
D2  60.94,69.68 180 top
D3  82.48,56.93 90 top
GND  9.45,71.5 0 bottom
H1  83.5,4 0 top
H2  42,72 0 top
H3  91,72 0 top
H4  42,4 0 top
H6  91,33 0 top
H8  42,33 0 top
H9  42,11 0 top
H10  83.5,11 0 top
HC0  70.5,59.5 0 top
HC1  70.1,47.2 270 top
HC12  18,26.5 180 bottom
JP1  62.5,13 180 top
JP2  60.44,31.67 180 top
JP3  62.5,1.8 180 top
K  9.15,54.3 0 bottom
OLED  18,66.95 180 top
PCU  29.55,47.5 90 bottom
PCUT  58.66,38.34 0 top
Q1  50.75,59.66 90 top
R1  18.58,49.05 90 bottom
R2  20.67,49.02 90 bottom
R3  16.5,49.05 90 bottom
R4  14.43,49.05 90 bottom
R5  26.17,48.52 0 bottom
R6  26.17,50.72 0 bottom
R7  26.26,26.61 0 bottom
R8  26.95,37.58 270 bottom
R9  26.9,45.12 90 bottom
R10  20.52,70.23 90 top
R11  18.11,70.23 270 top
R12  23.59,32.59 0 top
R13  4.76,25.25 270 top
R14  23.59,30.55 180 top
R15  6.99,25.25 90 top
R16  12.45,21.37 0 top
R17  15.75,14.3 90 top
R18  23.51,17.71 180 top
R19  12.45,19.04 180 top
R20  18.18,14.3 270 top
R21  23.51,19.74 0 top
R22  15.88,3.52 90 top
R23  18.21,3.52 270 top
R24  78.23,59.9 270 top
R25  47.57,60.72 90 top
R26  54.45,58.67 180 top
R27  54.43,60.87 180 top
R28  48.09,57.73 0 top
R29  70.79,39.67 180 top
R30  70.91,32.6 0 top
R31  70.9,34.7 180 top
R32  75.06,32.66 0 top
R33  75.05,34.83 180 top
R34  79.07,32.66 0 top
R35  79.06,34.81 180 top
R36  83.05,32.64 0 top
R37  82.92,34.89 180 top
R38  66.78,41 180 top
R39  66.79,38.98 180 top
R40  66.8,36.88 180 top
R41  66.8,34.8 180 top
S1  18,30.5 0 top
S2  18,19.5 0 top
S3  18,8.5 0 top
S4  7,19.5 0 top
S5  29,19.5 0 top
S6  7,30.5 0 top
S7  51,7.5 90 top
S8  59,7.5 90 top
S9  67,7.5 90 top
S10  75,7.5 270 top
TMR  50.23,46.37 270 top
TPVAO  22.67,49.61 180 bottom
U1  18.98,41.25 270 bottom
U2  10.12,35.67 90 bottom
U3  15.01,70.26 0 top
U4  58.63,47.34 0 top
U5  53.97,66.49 270 top
U6  62.1,66.45 270 top
U7  44.8,56.52 270 top
U8  79.23,55.73 180 top
U9  41.55,56.5 180 top
UPD  29.64,37.93 270 top
UPDT  58.56,55.49 0 top
VIN  44.37,62.17 90 top
VOUT  43.65,52.05 270 top
VOUT1  31.87,56.47 90 bottom
VOUT2  5.65,57.81 90 top

### Tracks (layer width: path | path; a pad name or v marks a point on that pad's centre or on a via)
12V_EN  (via drill 0.35)
  Top 0.305: R26.1 55.3,57.74 54.61,57.05 v53.09,57.05 | v53.28,40.62 53.28,41.6 53.33,41.65 53.95,41.65 U4.10
  Bottom 0.305: v53.09,57.05 53.09,40.81 v53.28,40.62
12VIN
  Top 0.305: 50.38,69.84 50.27,69.73 | C27.1 C25.1 49.5,66.55 50.38,66.55 50.6,66.33 50.6,62.3 50.1,61.8 47.8,61.8 R25.2 46.47,61.57 45.8,60.9 VIN.1 42.87,60.9 42.44,61.33
  Top 1.016: C25.1 49.3,68.76 50.27,69.73 | U5.3 50.38,69.84 | 42.44,61.33 42,61.77 42,65 43.55,66.55 C27.1 49.5,66.55
  pour Top (isolate 0.2, no thermals): 45.1,62 41.9,62 41.2,61.3 41.2,58.9 arc90 43,57.1 44.7,57.1 45.1,57.5 45.1,59.7 45.7,60.3 45.7,61.4
+12V
  pour Top (isolate 0.2, no thermals): 39.48,56.29 39.48,53.35 40.33,52.5 48.95,52.5 51.6,55.02 51.64,55.86 50.82,56.71 39.9,56.71
AX
  Top 0.305: TMR.2 51.17,51.78 U4.2
BX
  Top 0.305: TMR.3 50.56,50.51 U4.3
CX
  Top 0.305: TMR.4 51.83,49.24 U4.4
DX
  Top 0.305: TMR.5 50.23,45.99 52.22,47.97 U4.5
EX
  Top 0.305: TMR.6 51.74,44.07 51.74,46.24 52.2,46.7 U4.6
FX
  Top 0.305: TMR.7 52.3,42.09 52.3,45 52.73,45.43 U4.7
GND  (via drill 0.35)
  Top 0.254: 20.83,6.86 21.84,5.84 21.84,4.57 20.07,2.79 C12.2 | 21.08,16.76 21.08,17.27 20.83,17.53 S2.4 | 21.08,16.76 21.08,14.22 20.32,13.46 C10.2 | 21.08,16.76 25.4,16.76 26.16,17.53 S5.3 26.42,17.78 31.5,17.78 S5.4 31.75,17.78 31.75,19.3 33.02,20.57 33.02,22.1 28.96,26.16 | 20.83,6.86 20.83,8.38 22.1,9.65 22.1,11.43 20.32,13.21 C10.2 | 20.83,6.86 S3.4 | 13.21,10.41 11.68,11.94 11.68,16.26 | 13.21,10.41 15.24,8.38 15.24,6.86 S3.3 | 11.68,16.26 11.68,17.02 C9.2 11.43,17.27 10.16,17.27 9.91,17.53 S4.4 9.65,17.78 4.32,17.78 S4.3 4.3,19.12 3.1,20.32 3.05,20.32 3.05,26.92 4.06,27.94 4.06,28.45 S6.3 | 11.68,16.26 13.97,16.26 15.24,17.53 S2.3 | 13.21,10.41 14.22,11.43 17.78,11.43 19.56,13.21 20.07,13.21 C10.2 | C8.2 9.14,26.16 9.14,27.94 9.65,28.45 S6.4 9.91,28.7 11.68,28.7 13.46,30.48 | 24.38,24.38 24.38,26.92 22.86,28.45 C7.2 22.61,28.45 20.83,28.45 S1.4 20.57,28.7 15.49,28.7 S1.3 15.24,28.7 13.97,29.97 | 24.38,24.38 24.38,21.59 C11.2 | 13.46,30.48 v13.46,34.8 | 13.97,29.97 13.46,30.48 | 13.97,29.97 v14.22,29.97 | 28.96,26.16 27.18,24.38 24.38,24.38 | 28.96,26.16 29.46,26.67 29.46,35.31 UPD.3 29.72,35.56 30.99,36.83 30.99,49.02 29.72,50.29 29.72,51.31 PCU.4 29.46,51.56 16.46,64.57 | 16.46,64.57 15.01,66.01 15.01,66.13 OLED.4 | v9.07,47.6 v9.07,45.06 | 16.46,64.57 18.02,66.13 18.02,69.3 R11.2 | C20.2 85.5,55.67 85.5,54.5 84,53 73.56,53 72.51,51.95 72.51,41.51 71.64,40.64 R29.1 71.68,39.63 v73.09,39.63 | C22.2 74.08,36.57 v73.06,36.57 | C21.2 69.24,36.67 v68.95,36.38 | C23.2 78.12,36.57 v77.06,36.57 | C24.2 v81.09,36.69
  Top 0.305: U4.20 61.45,53.05 61.1,53.4 UPDT.3 | UPDT.3 | R27.2 52.11,60.87 Q1.2 52.06,60.82 v52.06,61.7 | C14.2 60.01,58.79 C13.2 | 60.02,57 60.02,56.57 UPDT.3 | 79.67,60.18 79.67,60 | C20.2 84.23,55.76 83.95,56.04 83.95,56.79 83.19,57.55 79.84,57.55 79.36,58.03 | JP3.6 56.35,2 58.69,2 | S5.4 33.7,17.65 43.05,27 45,27 49.67,31.67 JP2.5
  Top 0.406: v17.6,52.15 17.6,46.15 18.87,44.88 18.87,43.85 18.85,43.83 18.85,41.6 20.45,40.01 20.45,39.17 19.89,38.61 15.75,38.61 13.46,36.32 v13.46,34.8
  Top 0.508: S7.4 52.85,7.4 | 52.85,7.4 S7.3 | S8.4 60.85,7.4 | 60.85,7.4 S8.3 | S9.4 68.85,7.6 | 68.85,7.6 S9.3 | S10.3 73.15,7.6 | 73.15,7.6 S10.4 | 73.15,7.6 68.85,7.6 | 68.85,7.6 61.05,7.6 | 61.05,7.6 60.85,7.4 | 61.05,7.6 58.6,7.6 | 58.6,7.6 53.05,7.6 52.85,7.4 | JP3.5 58.69,2 58.69,7.51 58.6,7.6 | JP1.5 58.69,7.69 58.6,7.6 | HC1.2 68.52,49.74 67.96,50.3 67.96,53.93 68.47,54.44 69.47,54.44 69.82,54.79 69.82,55.26 | v58.49,63.37 59.78,63.37 C15.2 60,61.19
  Top 0.813: C14.2 60,61.19 60,58.8 C13.2 60.02,57.23 | 60.02,57.23 60.02,57 60.02,56.58 UPDT.3 | 60.02,57.23 67.36,57.23 67.96,57.83 HC0.2 67.96,61.46 68.56,62.06 77.44,62.06 78.23,61.27 R24.1 79.1,60.75 79.67,60.18 | C19.2 69.82,54.85 69.82,55.26 71.39,56.83 C18.2 | 79.67,60 79.67,58.34 79.36,58.03 78.16,56.83 C17.2 73.99,56.82 C18.2 | C18.2 | 58.2,72.2 C26.2 56.26,71.99 U5.1
  Top 1.016: 58.2,72.2 C16.2 | VIN.2 45.58,64.65 C27.2 C25.2 | U5.1 v56.26,68.52 v56.27,68.51
  Bottom 0.254: 12.64,49.82 12.7,49.78 12.92,50 13.51,50 | 12.64,49.82 C1.2 | C6.- 9.91,42.42 10.67,43.18 10.67,44.96 C5.2 | 13.51,50 13.51,54 14.51,55 16,55 18.23,52.77 | UPD.3 29.61,35.38 29.46,35.31 27.18,33.02 27.18,26.67 R7.1 33.38,26.61 47.4,12.59 | C4.2 8.38,28.7 8.38,26.67 C3.2 8.64,26.42 9.14,25.91 9.14,25.65 9.91,24.89 13.97,24.89 15.49,26.42 HC12.2 15.24,26.67 15.24,28.7 13.97,29.97 | 13.97,29.97 12.95,30.99 C2.2 | v13.46,34.8 13.46,36.58 U1.20 | v14.22,29.97 13.97,29.97 | v9.07,47.6 9.02,47.65 9.02,48.69 10.15,49.82 C1.2 12.64,49.82 | v73.06,36.57 73.06,39.6 v73.09,39.63 | v68.95,36.38 69.14,36.57 v73.06,36.57 | v73.06,36.57 v77.06,36.57 77.18,36.69 v81.09,36.69 | 13.51,50 14.33,50 R4.2
  Bottom 0.305: 46.11,61.7 VIN.2 | JP3.6 48.8,1.8 47.4,3.2 47.4,12.59
  Bottom 0.406: C5.2 9.08,45.07 v9.07,45.06
  Bottom 0.508: v58.49,63.37 55.63,63.37 54.68,64.32 | BAT-.TP 25.74,57.74 VOUT1.2 | VOUT2.2 5.65,67.7 GND.TP 14,66.95 OLED.4 21,60.14 BAT-.TP | v17.6,52.15 18.23,52.77 18.46,53 BAT-.TP
  Bottom 1.016: v56.27,68.51 56.27,65.91 54.68,64.32 v52.06,61.7 48.8,61.7 47,63.5 44,63.5 | JP2.5 55.36,36.47 55.28,36.55
  pour Bottom (no thermals): 47,65 41,65 38.5,62.5 38.5,46.3 46.4,38.4 46.4,36 47.8,34.6 50.7,34.6 52.1,36 64,36 64.47,36.47 64.47,39.53 64,40 53,40 51,42 49,42 49,63
M0
  Bottom 0.254: U2.1 11.18,34.54 12.45,34.54 12.95,34.04 13.97,34.04 14.54,34.6 U1.19
M0_T  (via drill 0.35)
  Top 0.254: U4.19 64.53,51.78 64.69,51.94 64.69,53.81 63.5,55 v63.5,56 | U6.1 63.11,62.39 v63.5,62
  Bottom 0.254: v63.5,62 v63.5,56
M1_T
  Top 0.254: U8.1 80.25,54.16 79.71,53.62 73.46,53.62 72,52.16 72,44.12 71.27,43.39 65.09,43.39 64.59,42.89 U4.12 61.71,42.89 61.33,42.51 61.33,41.02 61.75,40.6 63.61,40.6 65.1,39.11 65.81,39.11 R39.2
M1_T0
  Top 0.254: C23.1 79.94,37.73 79.5,38.16 69.14,38.16 68.32,38.98 R39.1
  Top 0.305: C23.1 79.94,34.84 R35.1
M1_T1  (via drill 0.35)  (1 unrouted)
  Top 0.254: R34.1 v77.17,32.66 v77.16,32.67
  Top 0.305: R35.2 R34.1
  Top 0.508: JP1.2 65.15,11.84 S9.2 64.2,10.2 v63.5,9.5 | S9.1 65.15,4.4 | 65.15,4.4 65.15,3.05 66.31,1.89 JP3.2 | v63.5,4.5 65.05,4.5 65.15,4.4
  Bottom 0.254: v77.16,32.67 76.45,31.96 69,31.96 67.04,33.92 63.6,33.92 62.98,33.3 JP2.2
  Bottom 0.508: v63.5,4.5 v63.5,9.5
N$1
  Top 0.254: R13.1 4.83,26.16 6.86,26.16 R15.2 7.11,26.16 7.11,32.26 | 7.11,32.26 9.65,32.26 S6.2 | 7.11,32.26 4.32,32.26 S6.1
N$2
  Bottom 0.254: U2.2 8.89,34.8 6.6,34.8 D1.C
N$3
  Top 0.254: OLED.3 16.73,68.78 16.03,69.49 U3.3
N$4
  Top 0.254: U3.1 17.92,71.27 R11.1 R10.2
N$5  (via drill 0.35)
  Top 0.254: 17.02,13.46 18.03,13.46 R20.2 | 17.02,13.46 15.75,13.46 R17.1 | S2.1 15.49,21.34 v17.02,21.34 20.57,21.34 S2.2 | v17.02,14.22 17.02,13.46
  Bottom 0.254: v17.02,21.34 v17.02,14.22
N$6
  Top 0.813: D2.C 61.08,68.02 U6.2
N$8
  Top 0.254: 17.02,2.79 18.03,2.79 R23.2 | 17.02,2.79 16,2.79 R22.1 | 17.02,10.41 20.57,10.41 S3.2 | 17.02,10.41 15.49,10.41 S3.1 | 17.02,10.41 17.02,2.79
N$9
  Top 0.254: R19.2 11.68,19.05 11.68,21.34 R16.1 11.43,21.34 9.91,21.34 S4.2 9.65,21.34 4.32,21.34 S4.1
N$10
  Top 0.254: R18.1 24.38,17.78 24.38,19.56 24.37,19.68 | 24.37,19.68 26.01,21.32 S5.1 26.42,21.34 31.5,21.34 S5.2 | 24.37,19.68 R21.2
N$11
  Top 0.305: R27.1 55.28,60.08 54.9,59.7 53.8,59.7 53.6,59.5 R26.2 51.89,58.67 Q1.1
N$12
  Top 0.254: R14.2 22.86,30.73 22.86,32.51 R12.1 22.61,32.51 20.83,32.51 S1.2 20.57,32.51 15.49,32.51 S1.1
N$13
  Top 0.254: R28.2 48.94,58.42 49.65,59.13 Q1.3
N$14
  Top 0.61: D3.C 82.48,56.21 81.95,56.74 U8.2
N$17
  Top 0.254: U9.1 42.57,56.2 42.87,56.5 44.31,56.5 44.36,56.55 45.62,56.55 45.81,56.74 U7.1 46,57.73 R28.1 47.57,58.06 R25.1
N$23
  Top 0.305: UPDT.2 58.9,55.15 58.9,50.2 61.13,47.97 U4.16
RXD0  (via drill 0.35)
  Top 0.254: R10.1 28.71,69.38 34.8,63.3 34.8,54.53 v31.9,51.64
  Bottom 0.254: 25.15,50.55 24.13,49.53 24.13,48.51 22.35,46.74 22.35,45.97 U1.8 | 25.15,50.55 25.41,50.81 25.41,51.62 25.73,51.94 27.99,51.94 28.58,52.53 31.04,52.53 31.9,51.66 v31.9,51.64 | 25.15,50.55 R6.2
RXD00
  Bottom 0.254: R6.1 27.18,50.55 27.94,50.55 29.46,49.02 PCU.3
RXD0_T
  Top 0.254: HC0.4 73.04,60.85 72.62,61.27 69.83,61.27 69.23,60.67 69.23,57.83 65.27,53.87 65.27,51.14 64.64,50.51 U4.18
RXD0PC
  Top 0.305: PCUT.3 59.93,39.51 55.28,44.16 U4.8
RXD1
  Bottom 0.254: HC12.4 20.32,26.67 20.32,32.16 17.07,35.4 U1.17
RXD1_T
  Top 0.254: U4.13 61.66,44.16 60.71,43.21 60.71,40.69 61.31,40.09 63.39,40.09 64.47,39.01 64.47,37.11 64.77,36.81 65.88,36.81 R40.2
  Top 0.305: HC1.4 69.94,44.5 65.1,44.5 64.76,44.16 U4.13
RXD1_T0
  Top 0.254: R40.1 68.38,36.88 69.14,37.64 75.66,37.64 75.89,37.41 C22.1
  Top 0.305: C22.1 R33.1
RXD1_T1  (via drill 0.35)  (1 unrouted)
  Top 0.254: R32.1 74.15,32.72 v72.97,32.72
  Top 0.305: R33.2 R32.1
  Top 0.508: S8.2 56.95,10 v56,10 | S8.1 56.85,4.5 v56,4.5
  Bottom 0.254: v72.97,32.72 71.16,34.53 61.74,34.53 60.44,33.23 JP2.3
  Bottom 0.508: 62.5,10.5 56.5,10.5 v56,10 v56,4.5 | 62.5,10.5 63.77,11.77 JP1.3 | JP3.3 62.5,3.07 62.5,10.5
S1  (via drill 0.35)
  Top 0.254: C7.1 24.64,28.7 24.64,30.48 R14.1 24.64,30.73 v25.65,30.73
  Bottom 0.254: U1.12 23.43,35.05 25.65,32.82 v25.65,30.73
S2  (via drill 0.35)
  Top 0.254: 19.56,15.24 18.29,15.24 R20.1 | 19.56,15.24 20.07,15.24 C10.1 | v19.56,16.51 19.56,15.24 | v25.15,25.4 25.15,27.43 25.65,27.94 v25.65,29.46
  Bottom 0.254: v19.56,16.51 19.56,19.81 v25.15,25.4 | U1.13 22.16,32.96 v25.65,29.46
S3  (via drill 0.35)
  Top 0.254: R23.1 18.29,4.32 19.81,4.32 C12.1 20.07,4.57 20.83,5.33 v21.08,5.33 | v26.67,25.15 26.67,27.69 v26.42,27.94
  Bottom 0.254: v21.08,5.33 21.08,19.56 v26.67,25.15 | v26.42,27.94 25.91,27.94 20.89,32.96 U1.14
S4  (via drill 0.35)
  Top 0.254: C9.1 13.46,17.27 13.46,18.8 R19.1 13.46,19.05 v14.48,19.05 | v4.57,34.04 14.73,44.2 v15.24,44.2
  Bottom 0.254: v14.48,19.05 9.14,19.05 4.57,23.62 v4.57,34.04 | U1.3 15.8,44.76 v15.24,44.2
S5  (via drill 0.35)
  Top 0.254: R21.1 22.86,19.81 22.86,21.34 C11.1 22.61,21.59 v19.81,24.38 | v8.13,33.02 14.99,39.88 v19.3,39.88
  Bottom 0.254: v19.81,24.38 8.38,24.38 7.37,25.4 7.37,32.26 v8.13,33.02 | U1.15 19.61,39.57 v19.3,39.88
S6  (via drill 0.35)
  Top 0.254: 7.11,24.38 8.89,24.38 C8.1 | v7.11,23.11 7.11,24.38 | v6.86,33.02 v18.03,44.2 17.17,44.2 13.55,47.82 13.55,51.24 12.47,52.32 v9.4,52.32 | 7.11,24.38 R15.1
  Bottom 0.254: v7.11,23.11 7.11,24.64 6.86,24.89 v6.86,33.02 | v18.03,44.2 19.18,44.2 19.61,44.63 19.61,45.88 U1.6 | v9.4,52.32 9.4,54.1 K.TP
SCL
  Bottom 0.254: OLED.2 19.3,67.06 20.57,68.33 28.45,68.33 34.54,62.24 34.54,40.54 31.2,37.2 | U1.11 26.81,36.59 R8.2 30.73,36.73 31.2,37.2 | JP1.6 47.94,13 39.37,21.57 39.37,26.37 32.4,33.34 32.4,36 31.2,37.2
SDA
  Bottom 0.254: OLED.1 21.84,66.8 29.21,66.8 33.92,62.09 33.92,48.9 29.97,44.96 29.21,44.96 28.19,45.97 R9.2 26.83,45.9 U1.10
SET  (via drill 0.35)
  Top 0.254: v14.48,42.67 14.48,41.91 v5.84,33.27
  Bottom 0.254: R7.2 25.4,26.67 23.11,26.67 HC12.5 22.86,26.42 22.86,25.15 20.07,22.35 6.6,22.35 5.84,23.11 v5.84,33.27 | v14.48,42.67 14.48,45.72 U1.2
SET0_T
  Top 0.254: HC0.5 75.58,58.24 75.36,58.02 71.07,58.02 66.5,53.45 66.5,47.5 65.7,46.7 U4.15
  Top 0.305: HC0.5 76.03,59.05 R24.2
SET1_T
  Top 0.254: HC1.5 70.1,39.83 R29.2 | R38.2 65.93,42.51 66.04,42.62
  Top 0.305: HC1.5 69.6,42.62 66.04,42.62 65.52,42.62 64.52,41.62 U4.11
SET1_T0
  Top 0.254: R38.1 68.38,41 68.8,40.58 68.8,39.22 69.28,38.74 69.33,38.69 83.17,38.69 83.82,38.04 83.82,36.77 C24.1
  Top 0.305: R37.1 83.91,35.02 C24.1
SET1_T1  (via drill 0.35)  (1 unrouted)
  Top 0.254: R36.1 v81.07,32.64
  Top 0.305: R37.2 82.2,34.76 R36.1
  Top 0.508: JP1.1 76,13 76.85,12.15 S10.1 S10.2 76.85,3.45 75.4,2 69.05,2 JP3.1
  Bottom 0.254: v81.07,32.64 81.1,32.61 81.1,31.86 80.18,30.94 66.25,30.94 JP2.1
TXD0
  Bottom 0.254: R5.2 25.15,48.51 23.62,46.99 23.62,45.97 U1.9
TXD00
  Bottom 0.254: R5.1 27.18,48.51 29.46,46.23 PCU.2
TXD0_T
  Top 0.305: HC0.3 70.5,58.2 65.88,53.58 65.88,50.38 64.7,49.2 63.33,49.2 U4.17
TXD0PC
  Top 0.305: U4.9 55.11,42.89 57.39,40.61 PCUT.2
TXD1
  Bottom 0.254: HC12.3 17.78,26.67 17.78,33.3 15.8,35.27 U1.18
TXD1_T
  Top 0.254: U4.14 61.43,45.43 60.08,44.08 60.08,40.36 60.96,39.48 62.95,39.48 63.12,39.31 63.26,39.31 63.89,38.68 63.89,35.96 65.05,34.8 R41.2
  Top 0.305: HC1.3 67.7,47.2 65.93,45.43 U4.14
TXD1_T0
  Top 0.254: R41.1 68.47,34.8 69.34,35.67 71.77,35.67
  Top 0.305: C21.1 71.77,35.67 71.77,34.72 R31.1
TXD1_T1  (via drill 0.35)  (1 unrouted)
  Top 0.254: R31.2 69.79,34.44 68.88,34.44 68.11,33.67 58.3,33.67 57.9,33.27 JP2.4
  Top 0.305: R31.2 R30.1
  Top 0.508: S7.1 S7.2 50.8,10.2 v51,10
  Bottom 0.508: 53.4,11.5 60,11.5 61.23,12.73 JP1.4 | JP3.4 59.63,3.4 55,3.4 53.4,5 53.4,11.5 | 53.4,11.5 51.7,11.5 51,10.8 v51,10
UPDI
  Bottom 0.254: U1.16 18.54,36.83 18.54,40.39 18.8,40.64 27.18,40.64 29.72,38.1 UPD.2
VA
  Bottom 0.254: R2.1 20.83,48.01 20.83,45.97 U1.7
VAO
  Bottom 0.254: R2.2 20.83,49.78 22.61,49.78 TPVAO.TP
VB
  Bottom 0.254: C1.1 12.7,48.01 14.22,48.01 R4.1 14.48,48.26 16.26,48.26 R3.1 16.51,48.01 17.02,47.5 17.02,45.97 U1.4
VBAT  (via drill 0.35)
  Top 0.508: BAT+.TP 16.44,54.44 18,54.44 | v25.46,53.65 24.67,54.44 18,54.44 | 18,54.44 18,55.16 16.62,56.54 VOUT2.1
  Bottom 0.254: R3.2 16.26,50.04 16.26,51.82 15.24,52.83 BAT+.TP
  Bottom 0.508: v25.46,53.65 27.01,55.2 VOUT1.1
  other vias: 15,53
VC
  Bottom 0.254: R1.1 18.54,48.01 18.54,45.97 U1.5
VCC  (via drill 0.35)
  Top 0.254: R17.2 15.75,16 16.51,16.76 16.51,18.54 16.26,18.8 | 16.26,18.8 14.73,20.32 14.22,20.32 13.21,21.34 R16.2 13.21,21.59 12.45,22.35 6.6,22.35 6.35,22.61 6.35,22.86 4.83,24.38 R13.2 4.57,24.64 3.81,25.4 3.81,26.92 4.06,27.18 4.83,27.18 5.59,27.94 5.59,29.46 5.33,29.72 3.81,29.72 | 3.81,29.72 3.3,29.72 2.54,28.96 2.54,17.27 15.24,4.57 15.75,4.57 R22.2 | 16.26,18.8 21.59,18.8 22.61,17.78 R18.2 | R12.2 24.64,32.77 24.64,38.89 25.63,39.88 v26.67,39.88 28.96,39.88 29.46,40.39 UPD.1 29.72,40.64 29.72,43.69 PCU.1 | v3.81,30.99 3.81,29.72 | U3.2 13.97,69.22 10.67,69.22 9.45,68 5V.TP | v32,44 33,43 33,34 38.82,28.18 44.32,28.18 54.47,38.34 PCUT.1 58.19,35 v60,35 | v77.01,33.99 75.91,32.9 R32.2
  Top 0.305: UPDT.1 54.51,55.49 54.5,55.5 53.9,54.9 53.9,53.13 U4.1 | PCUT.1 54.85,39.83 v55.71,40.69 | 82.63,58.87 D3.A | R30.2 71.76,31.44 72,31.2 75.8,31.2 | 75.8,31.2 79.9,31.2 | 79.9,31.2 83.5,31.2 83.9,31.6 R36.2 | R34.2 79.92,31.22 79.9,31.2 | R32.2 75.91,31.31 75.8,31.2
  Top 0.508: D2.A 59.14,66.14 57.5,64.5 57.5,58 56.02,56.52 UPDT.1
  Top 0.813: D2.A 60.27,70.81 C16.1 60.4,72.5 64,72.5 64.5,72 64.5,63.5 64.88,63.12 79.09,63.12 82.48,59.73 D3.A | C20.1 85.42,58.58 85,59 82.75,59 82.63,58.87
  Top 1.016: U5.2 53.97,72.02 | 53.97,72.02 C26.1 | C16.1 60.27,74.2 60,74.47 54.47,74.47 53.97,73.97 53.97,72.02
  Bottom 0.254: 29.51,43.82 29.46,43.94 29.13,44.27 R9.1 26.66,44.03 21.12,44.03 19,41.91 13.97,41.91 13.21,42.67 | 29.51,43.82 PCU.1 | C5.1 10.92,46.74 12.45,46.74 13.21,45.97 U1.1 13.21,45.72 13.21,42.67 | 13.21,42.67 9.91,39.37 C6.+ 9.65,39.12 8.89,38.35 6.6,38.35 D1.A 6.35,38.1 3.81,35.56 v3.81,30.99 | 9.4,65.79 5V.TP | R8.1 26.95,39.6 v26.67,39.88 | v32,44 31.82,43.82 29.51,43.82 | v60,35 61.49,35 61.53,35.04 75.96,35.04 v77.01,33.99
  Bottom 0.305: v55.71,40.69 55.71,52.71 56.02,53.02 UPDT.1
  Bottom 0.406: C5.1 10.33,46.63 7.32,46.63 7.24,46.71 | 9.4,65.79 7.24,63.63 7.24,46.71 | 6.35,38.1 6.35,42.34 7.24,43.23 7.24,46.71
  other vias: 9.45,65.8
VCHG
  Bottom 0.254: CHG.TP 32.05,62.04 33.3,60.79 33.3,54.3 32.26,53.26 28.28,53.26 27.54,52.52 24.33,52.52 22.9,51.09 19.07,51.09 18.72,50.74 18.72,50.04 R1.2
VDD
  Bottom 0.254: HC12.1 12.95,26.67 12.95,28.96 C2.1 12.7,28.96 10.41,28.96 C4.1 | U2.3 10.16,36.58 10.16,28.96 C4.1 | C3.1 10.41,26.67 10.41,28.7 C4.1
VDD0
  Top 0.305: 61.91,63.59 C15.1 | 61.9,61.19 C14.1 61.91,59 61.91,58.79 | 61.91,58.79 C13.1 | HC0.1 65.21,59.29 64.71,58.79 61.91,58.79
  Top 0.813: U6.3 62.1,63.78 61.91,63.59 | C15.1 61.9,61.19 61.9,59.01 61.91,59 | C13.1 62.42,59.29 65.21,59.29
VDD1
  Top 0.305: C17.1 | 71.84,54.93 C19.1
  Top 0.61: U8.3 78.22,55.22 77.93,54.93 C17.1 | C19.1 71.74,53.74 70.28,52.28 HC1.1 | C17.1 73.99,54.92 C18.1 71.84,54.93

### Text on the board
tPlace: G | G | DADABHAGWAN.ORG
bPlace: DADABHAGWAN.ORG | DADABHAGWAN.ORG | DADABHAGWAN.ORG